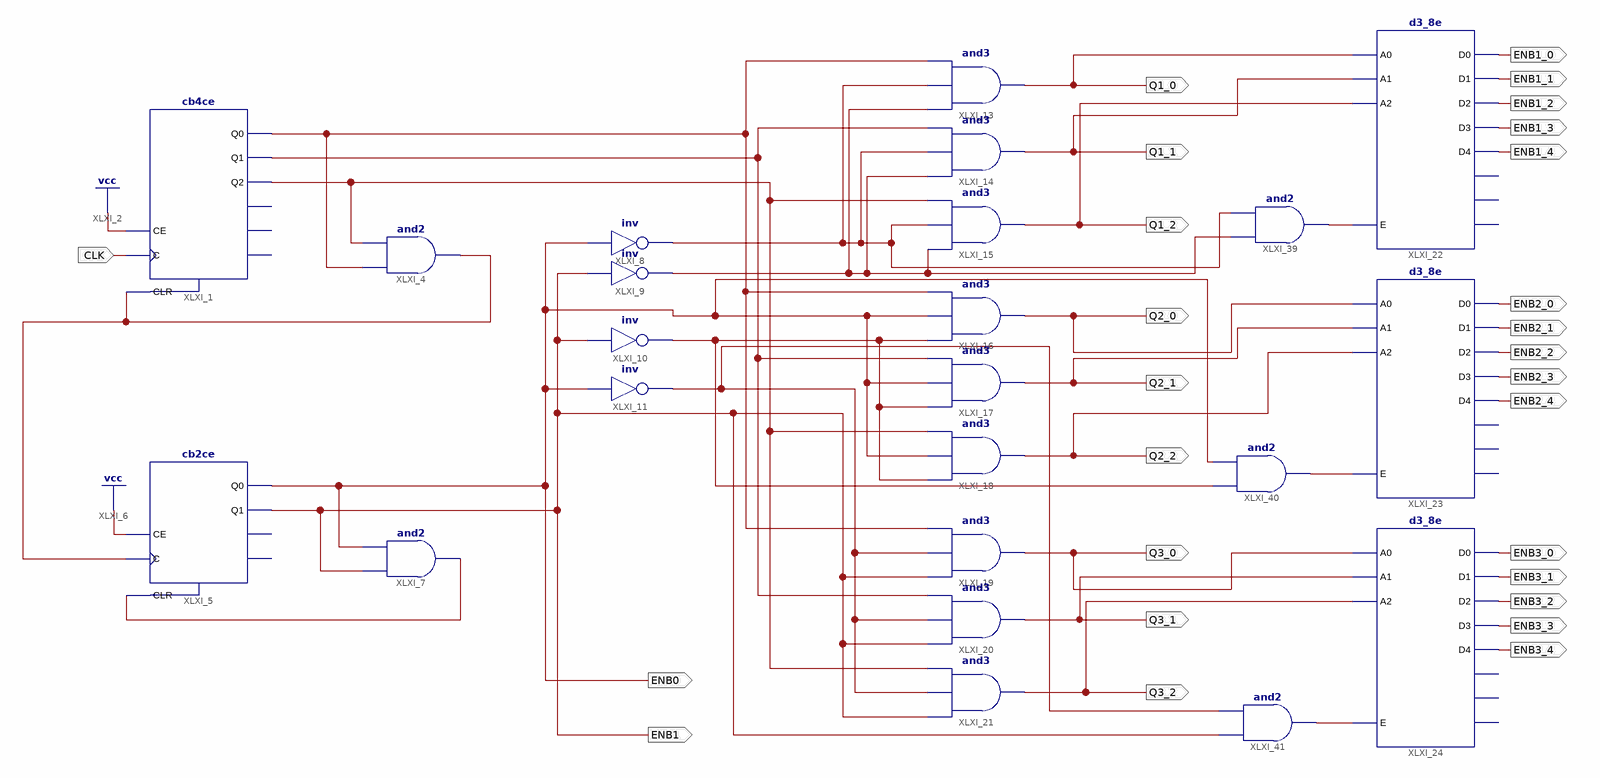
[diagram p0: schematic sheet 1]
// Xilinx ISE schematic sevensegDriver.sch (spartan3) as structural Verilog: 23 symbols, 27 ports
module sevensegDriver (
  input  CLK,
  output ENB0,
  output ENB1,
  output Q3_2,
  output Q3_1,
  output Q3_0,
  output Q2_2,
  output Q2_1,
  output Q2_0,
  output Q1_2,
  output Q1_1,
  output Q1_0,
  output ENB1_0,
  output ENB1_1,
  output ENB1_2,
  output ENB1_3,
  output ENB1_4,
  output ENB2_0,
  output ENB2_1,
  output ENB2_2,
  output ENB2_3,
  output ENB2_4,
  output ENB3_0,
  output ENB3_1,
  output ENB3_2,
  output ENB3_3,
  output ENB3_4
);

  wire Q0, Q2, XLXN_8, XLXN_12, XLXN_13, XLXN_14, XLXN_15, XLXN_31, XLXN_79, XLXN_97, XLXN_98, XLXN_118;

  cb4ce XLXI_1 (.C(CLK), .CE(1'b1), .CLR(XLXN_8), .Q0(Q0), .Q1(XLXN_13), .Q2(Q2));  // open: CEO, Q3, TC
  and XLXI_4 (XLXN_8, Q0, Q2);
  cb2ce XLXI_5 (.C(XLXN_8), .CE(1'b1), .CLR(XLXN_12), .Q0(ENB0), .Q1(ENB1));  // open: CEO, TC
  and XLXI_7 (XLXN_12, ENB1, ENB0);
  not XLXI_8 (XLXN_14, ENB0);
  not XLXI_9 (XLXN_15, ENB1);
  not XLXI_10 (XLXN_118, ENB1);
  not XLXI_11 (XLXN_31, ENB0);
  and XLXI_13 (Q1_0, XLXN_15, XLXN_14, Q0);
  and XLXI_14 (Q1_1, XLXN_15, XLXN_14, XLXN_13);
  and XLXI_15 (Q1_2, XLXN_15, XLXN_14, Q2);
  and XLXI_16 (Q2_0, XLXN_118, ENB0, Q0);
  and XLXI_17 (Q2_1, XLXN_118, ENB0, XLXN_13);
  and XLXI_18 (Q2_2, XLXN_118, ENB0, Q2);
  and XLXI_19 (Q3_0, ENB1, XLXN_31, Q0);
  and XLXI_20 (Q3_1, ENB1, XLXN_31, XLXN_13);
  and XLXI_21 (Q3_2, ENB1, XLXN_31, Q2);
  d3_8e XLXI_22 (
    .A0(Q1_0), .A1(Q1_1), .A2(Q1_2), .E(XLXN_79), .D0(ENB1_0), .D1(ENB1_1), .D2(ENB1_2), .D3(ENB1_3),
    .D4(ENB1_4));  // open: D5, D6, D7
  d3_8e XLXI_23 (
    .A0(Q2_0), .A1(Q2_1), .A2(Q2_2), .E(XLXN_97), .D0(ENB2_0), .D1(ENB2_1), .D2(ENB2_2), .D3(ENB2_3),
    .D4(ENB2_4));  // open: D5, D6, D7
  d3_8e XLXI_24 (
    .A0(Q3_0), .A1(Q3_1), .A2(Q3_2), .E(XLXN_98), .D0(ENB3_0), .D1(ENB3_1), .D2(ENB3_2), .D3(ENB3_3),
    .D4(ENB3_4));  // open: D5, D6, D7
  and XLXI_39 (XLXN_79, XLXN_15, XLXN_14);
  and XLXI_40 (XLXN_97, XLXN_118, ENB0);
  and XLXI_41 (XLXN_98, ENB1, XLXN_31);
endmodule
